# Altium schematic sheet 02_MCU_Interface.SchDoc
size A4
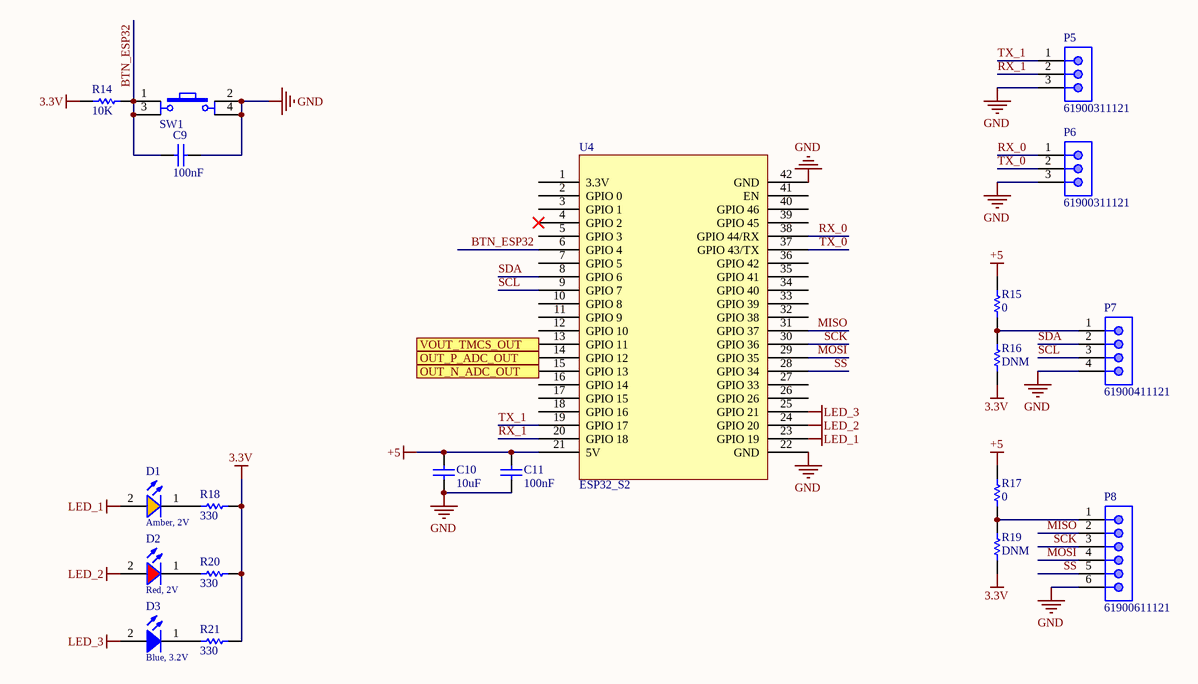
[diagram p0: 02_MCU_Interface.SchDoc]

## Parts
C9  value 100nF  [CAP-SM-0805]  (hidden comment: Cap Non-Pol SMD)
C10  value 10uF  [CAP-SM-0805]  (hidden comment: Cap Non-Pol SMD)
C11  value 100nF  [CAP-SM-0805]  (hidden comment: Cap Non-Pol SMD)
D1  Amber, 2V  [WL-SMCW_0603_H=0.7mm]
D2  Red, 2V  [WL-SMCW_0603_H=0.7mm]
D3  Blue, 3.2V  [WL-SMCW_0603_H=0.7mm]
P5  61900311121  [61900311121]
P6  61900311121  [61900311121]
P7  61900411121  [61900411121]
P8  61900611121  [61900611121]
R14  value 10K  [RES 1/2W]  (hidden comment: RESISTOR)
R15  value 0  [RES-SM-0603]  (hidden comment: RESISTOR SMD)
R16  value DNM  [RES-SM-0603]  (hidden comment: RESISTOR SMD)
R17  value 0  [RES-SM-0603]  (hidden comment: RESISTOR SMD)
R18  value 330  [RES-SM-0603]  (hidden comment: RESISTOR SMD)
R19  value DNM  [RES-SM-0603]  (hidden comment: RESISTOR SMD)
R20  value 330  [RES-SM-0603]  (hidden comment: RESISTOR SMD)
R21  value 330  [RES-SM-0603]  (hidden comment: RESISTOR SMD)
SW1  SW  [Tact SW 4 pin]  (value not drawn)
U4  ESP32_S2  [ESP32_S2]

## Ports
OUT_N_ADC_OUT (in), OUT_P_ADC_OUT (in), VOUT_TMCS_OUT (in)

## Nets
3.3V: R14.1 R16.1 R18.2 R19.1 R20.2 R21.2
+5: C10.1 C11.1 R15.2 R17.2 U4.21(5V)
GND: C9.2 C10.2 C11.2 P5.3 P6.3 P7.4 P8.6 SW1.2 SW1.4 U4.22(GND) U4.42(GND)
LED_1: D1.2(A) U4.23(GPIO_19)
LED_2: D2.2(A) U4.24(GPIO_20)
LED_3: D3.2(A) U4.25(GPIO_21)
BTN_ESP32: C9.1 R14.2 SW1.1 SW1.3 U4.6(GPIO_4)
MISO: P8.2 U4.31(GPIO_37)
MOSI: P8.4 U4.29(GPIO_35)
OUT_N_ADC_OUT: U4.15(GPIO_13) ; port OUT_N_ADC_OUT
OUT_P_ADC_OUT: U4.14(GPIO_12) ; port OUT_P_ADC_OUT
RX_0: P6.1 U4.38(GPIO_44/RX)
RX_1: P5.2 U4.20(GPIO_18)
SCK: P8.3 U4.30(GPIO_36)
SCL: P7.3 U4.9(GPIO_7)
SDA: P7.2 U4.8(GPIO_6)
SS: P8.5 U4.28(GPIO_34)
TX_0: P6.2 U4.37(GPIO_43/TX)
TX_1: P5.1 U4.19(GPIO_17)
VOUT_TMCS_OUT: U4.13(GPIO_11) ; port VOUT_TMCS_OUT
NetD1_1: D1.1(K) R18.1
NetD2_1: D2.1(K) R20.1
NetD3_1: D3.1(K) R21.1
NetP7_1: P7.1 R15.1 R16.2
NetP8_1: P8.1 R17.1 R19.2

Not connected (* = marked no-connect by the designer): U4 1(3.3V) 2(GPIO_0) 3(GPIO_1) 4(GPIO_2)* 5(GPIO_3) 7(GPIO_5) 10(GPIO_8) 11(GPIO_9) 12(GPIO_10) 16(GPIO_14) 17(GPIO_15) 18(GPIO_16) 26(GPIO_26) 27(GPIO_33) 32(GPIO_38) 33(GPIO_39) 34(GPIO_40) 35(GPIO_41) 36(GPIO_42) 39(GPIO_45) 40(GPIO_46) 41(EN)

## Library data of the parts
C9-C11 = Cap Non-Pol SMD: Capacitor
D1 = 150060AS75000: WL-SMCW SMT Mono-color Chip LED Waterclear, size 0603, Amber, 2V, 140deg; Chip Technology: AlInGaP; Dominant Wavelength typ.: 605nm; Luminous Intensity typ.: 130mcd; Peak Wavelength typ.: 610nm; Viewing Angle: 140deg; ComponentLink1Description: Manufacturer; ComponentLink1URL: http://www.we-online.de; ComponentLink2URL: https://www.we-online.com/catalog/datasheet/150060AS75000.pdf; ComponentLink2Description: Datasheet; Forward Voltage typ.: 2V; Emitting Color: Amber; Mounting Technology: SMT; Operating Temperature: -40 to +85degC; Published Date: December 2019; Part Number: 150060AS75000; Packaging: Tape and Reel; Size: 0603; Publisher: Wurth Elektronik
D2 = 150060RS75000: WL-SMCW SMT Mono-color Chip LED Waterclear, size 0603, Red, 2V, 140deg; Chip Technology: AlInGaP; Dominant Wavelength typ.: 625nm; Luminous Intensity typ.: 250mcd; Peak Wavelength typ.: 630nm; Viewing Angle: 140deg; ComponentLink1Description: Manufacturer; ComponentLink1URL: http://www.we-online.de; ComponentLink2URL: https://www.we-online.com/catalog/datasheet/150060RS75000.pdf; ComponentLink2Description: Datasheet; Forward Voltage typ.: 2V; Emitting Color: Red; Mounting Technology: SMT; Operating Temperature: -40 to +85degC; Published Date: December 2019; Part Number: 150060RS75000; Packaging: Tape and Reel; Size: 0603; Publisher: Wurth Elektronik
D3 = 150060BS75000: WL-SMCW SMT Mono-color Chip LED Waterclear, size 0603, Blue, 3.2V, 140deg; Chip Technology: InGaN; Dominant Wavelength typ.: 470nm; Luminous Intensity typ.: 145mcd; Peak Wavelength typ.: 465nm; Viewing Angle: 140deg; ComponentLink1Description: Manufacturer; ComponentLink1URL: http://www.we-online.de; ComponentLink2URL: https://www.we-online.com/catalog/datasheet/150060BS75000.pdf; ComponentLink2Description: Datasheet; Forward Voltage typ.: 3.2V; Emitting Color: Blue; Mounting Technology: SMT; Operating Temperature: -40 to +85degC; Published Date: December 2019; Part Number: 150060BS75000; Packaging: Tape and Reel; Size: 0603; Publisher: Wurth Elektronik
P5 P6 = 61900311121: WR-WTB THT Male Vertical Locking Header, pitch 2.54mm, 3p; Pin Number: 3; Contact Resistance: 20mOhm; Rated Current: 3A; Withstanding Voltage: 1000VAC; Working Voltage: 250VAC; ComponentLink1Description: Manufacturer; ComponentLink1URL: http://www.we-online.de; ComponentLink2Description: Datasheet; ComponentLink2URL: https://www.we-online.com/catalog/datasheet/61900311121.pdf; Pitch: 2.54mm; Published Date: January 2020; Publisher: Wurth Elektronik; Mounting Technology: THT; Packaging: Bag; Operating Temperature: -40 to +105degC; Part Number: 61900311121; Gender: Male; Type: Vertical
P7 = 61900411121: WR-WTB THT Male Vertical Locking Header, pitch 2.54mm, 4p; Pin Number: 4; Contact Resistance: 20mOhm; Rated Current: 3A; Withstanding Voltage: 1000VAC; Working Voltage: 250VAC; ComponentLink1Description: Manufacturer; ComponentLink1URL: http://www.we-online.de; ComponentLink2Description: Datasheet; ComponentLink2URL: https://www.we-online.com/catalog/datasheet/61900411121.pdf; Pitch: 2.54mm; Published Date: January 2020; Publisher: Wurth Elektronik; Mounting Technology: THT; Packaging: Bag; Operating Temperature: -40 to +105degC; Part Number: 61900411121; Gender: Male; Type: Vertical
P8 = 61900611121: WR-WTB THT Male Vertical Locking Header, pitch 2.54mm, 6p; Pin Number: 6; Contact Resistance: 20mOhm; Rated Current: 3A; Withstanding Voltage: 1000VAC; Working Voltage: 250VAC; ComponentLink1Description: Manufacturer; ComponentLink1URL: http://www.we-online.de; ComponentLink2Description: Datasheet; ComponentLink2URL: https://www.we-online.com/catalog/datasheet/61900611121.pdf; Pitch: 2.54mm; Published Date: January 2020; Publisher: Wurth Elektronik; Mounting Technology: THT; Packaging: Bag; Operating Temperature: -40 to +105degC; Part Number: 61900611121; Gender: Male; Type: Vertical
R15-R21 = RESISTOR SMD: Resistor
SW1 = Tact SW - 4Pin: Switch button 4 pin; Value: Button chip 4 pin